# EAGLE schematic 7474-strobe-generator-v3 (EAGLE 9.4.1)
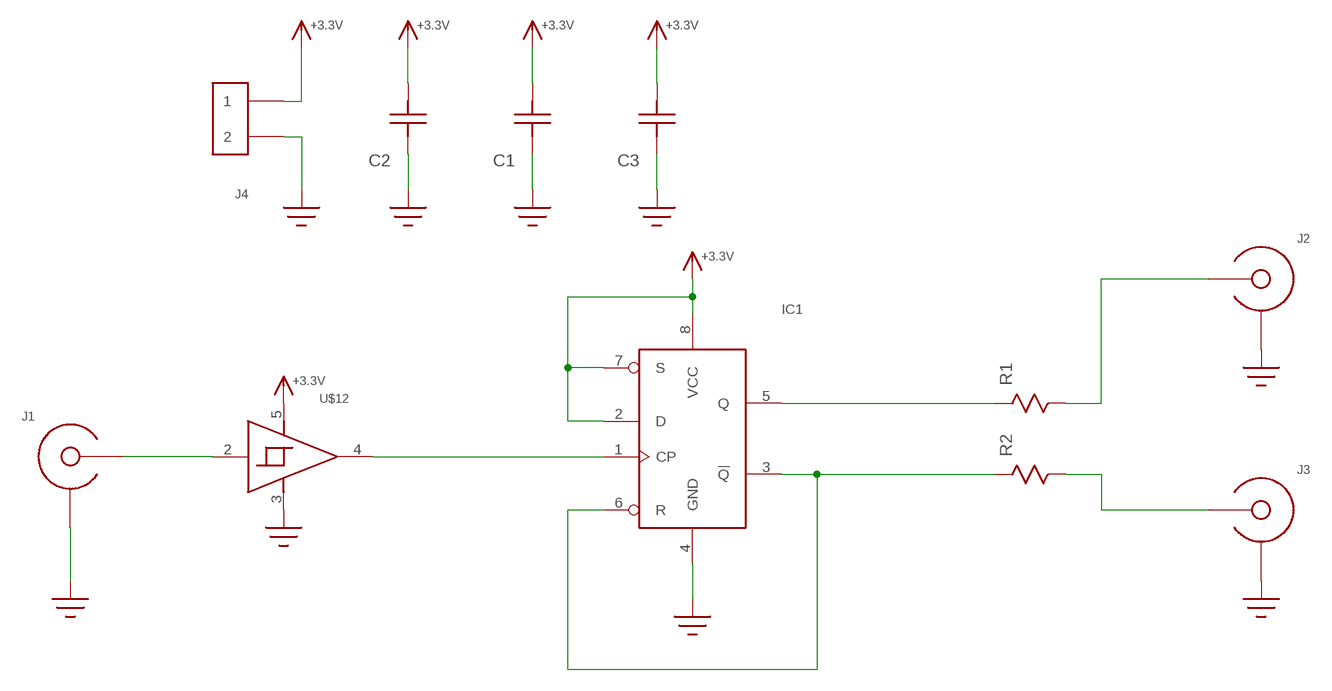
[diagram p0: schematic, sheet 1]

## Parts
C1  C0603  [C0603]
C2  C1206  [1206]
C3  C0603  [C0603]
IC1  74LVC2G74  [SSOP8]
J1  SMA-EDGE-LAUNCH4020_TAPER  [SMA_EDGE_LAUNCH_2L_4020_TAPER]
J2  SMA-EDGE-LAUNCH4020_TAPER  [SMA_EDGE_LAUNCH_2L_4020_TAPER]
J3  SMA-EDGE-LAUNCH4020_TAPER  [SMA_EDGE_LAUNCH_2L_4020_TAPER]
J4  HEADER_2PIN  [HEADER_2PIN]
R1  R0603  [R0603]
R2  R0603  [R0603]
U$12  74LVC1G17  [SOT23-5]

## Nets
+3.3V: C1.P$1 C2.P$1 C3.P$1 IC1.2(D) IC1.7(S) IC1.8(VCC) J4.1 U$12.5(VCC)
GND: C1.P$2 C2.P$2 C3.P$2 IC1.4(GND) J1.BOTTOM_GND(SHIELD) J1.GND@1(SHIELD) J1.GND@2(SHIELD) J1.GND@3(SHIELD) J1.GND@4(SHIELD) J1.GND@5(SHIELD) J1.GND@6(SHIELD) J1.GND@7(SHIELD) J1.GND@8(SHIELD) J1.GND@14(SHIELD) J1.GND@15(SHIELD) J1.GND@16(SHIELD) J1.GND@17(SHIELD) J1.GND_PAD1(SHIELD) J1.GND_PAD2(SHIELD) J1.P$1(SHIELD) J1.P$2(SHIELD) J2.BOTTOM_GND(SHIELD) J2.GND@1(SHIELD) J2.GND@2(SHIELD) J2.GND@3(SHIELD) J2.GND@4(SHIELD) J2.GND@5(SHIELD) J2.GND@6(SHIELD) J2.GND@7(SHIELD) J2.GND@8(SHIELD) J2.GND@14(SHIELD) J2.GND@15(SHIELD) J2.GND@16(SHIELD) J2.GND@17(SHIELD) J2.GND_PAD1(SHIELD) J2.GND_PAD2(SHIELD) J2.P$1(SHIELD) J2.P$2(SHIELD) J3.BOTTOM_GND(SHIELD) J3.GND@1(SHIELD) J3.GND@2(SHIELD) J3.GND@3(SHIELD) J3.GND@4(SHIELD) J3.GND@5(SHIELD) J3.GND@6(SHIELD) J3.GND@7(SHIELD) J3.GND@8(SHIELD) J3.GND@14(SHIELD) J3.GND@15(SHIELD) J3.GND@16(SHIELD) J3.GND@17(SHIELD) J3.GND_PAD1(SHIELD) J3.GND_PAD2(SHIELD) J3.P$1(SHIELD) J3.P$2(SHIELD) J4.2 U$12.3(GND)
N$1: IC1.1(CP) U$12.4(OUT)
N$2: IC1.3(!Q!) IC1.6(R) R2.P$1
N$3 [29-6]: J2.CENTER@1(CENTER) R1.P$2
N$4: IC1.5(Q) R1.P$1
N$5 [29-6]: J3.CENTER@1(CENTER) R2.P$2
N$6: J1.CENTER@1(CENTER) U$12.2(IN)

## Library data of the parts
C1-C3 = yapo:C
IC1 = yapo:74LVC2G74
J1-J3 = yapo:SMA-EDGE-LAUNCH
J4 = yapo:HEADER_2PIN
R1 R2 = yapo:R
U$12 = yapo:74LVC1G17

## Net classes
1 29-6: width 0.737 mm, clearance 0.152 mm